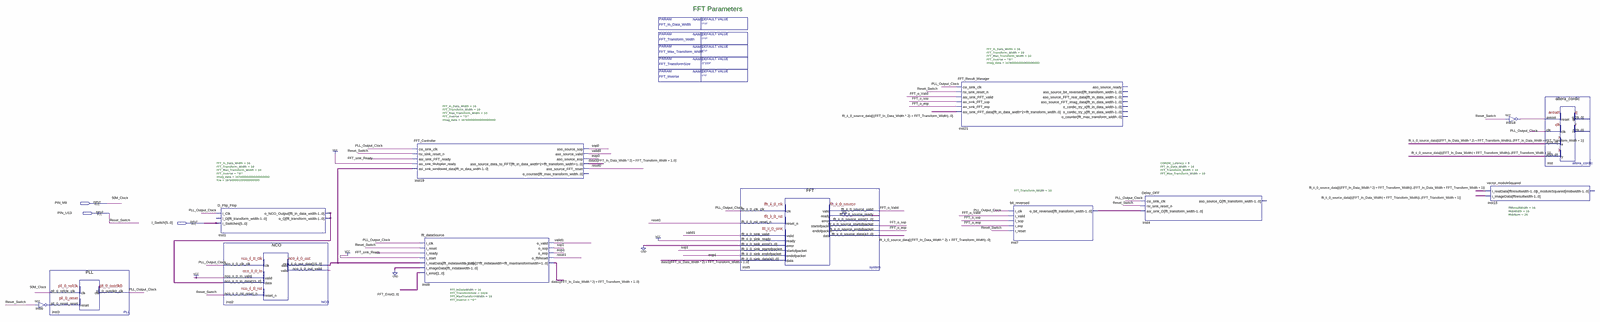
[diagram p0: schematic sheet, whole]
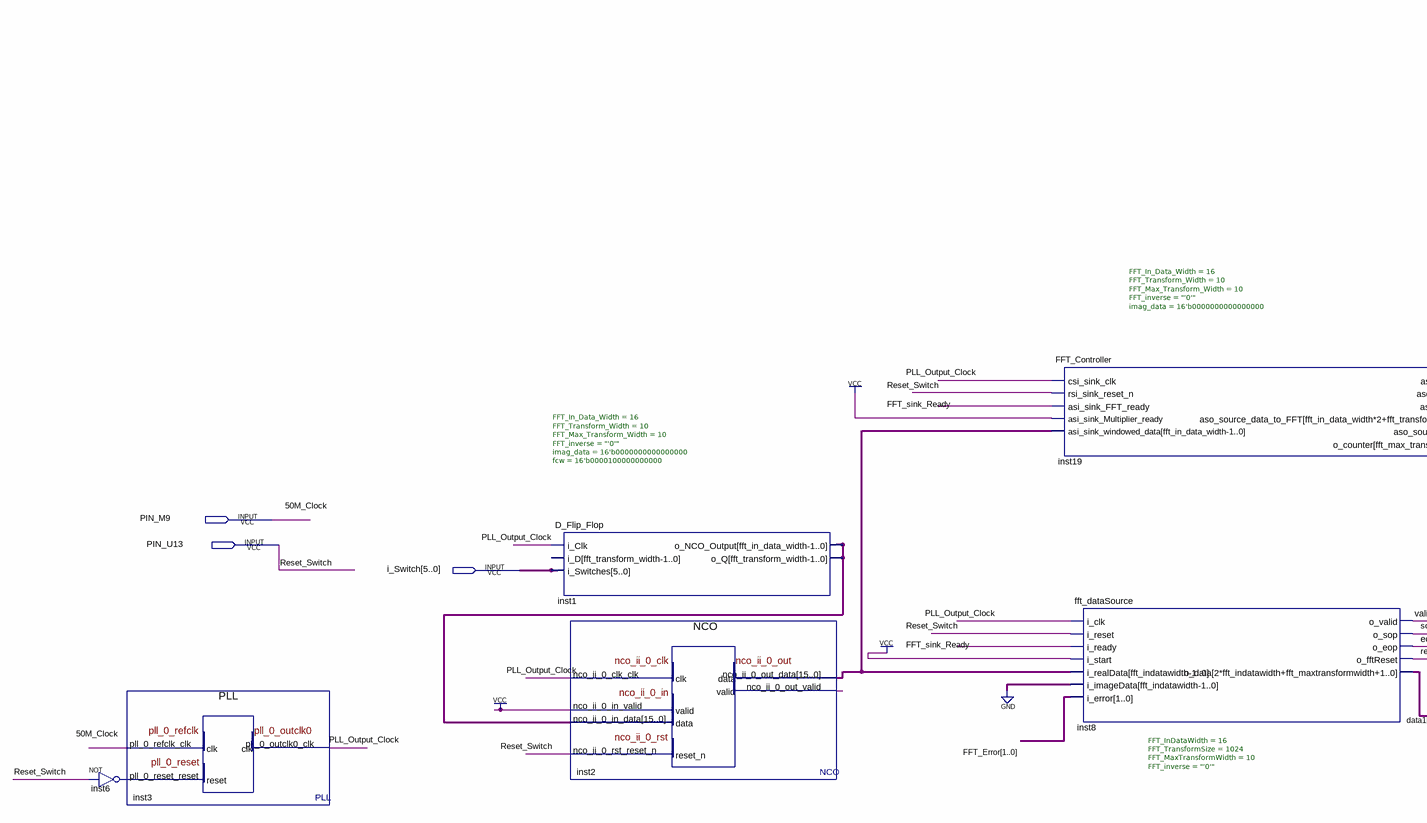
[diagram p1: schematic sheet, left part]
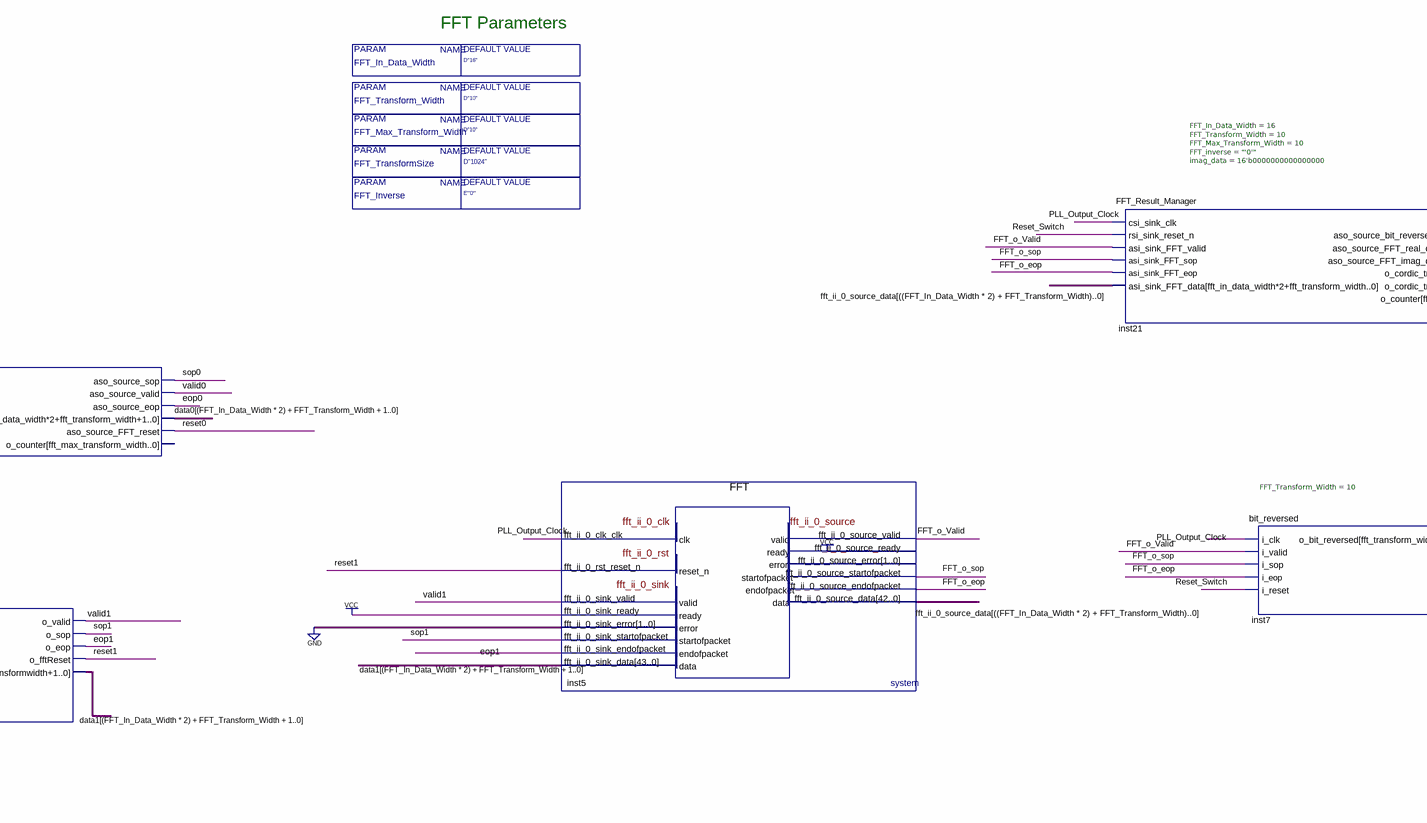
[diagram p2: schematic sheet, centre part]
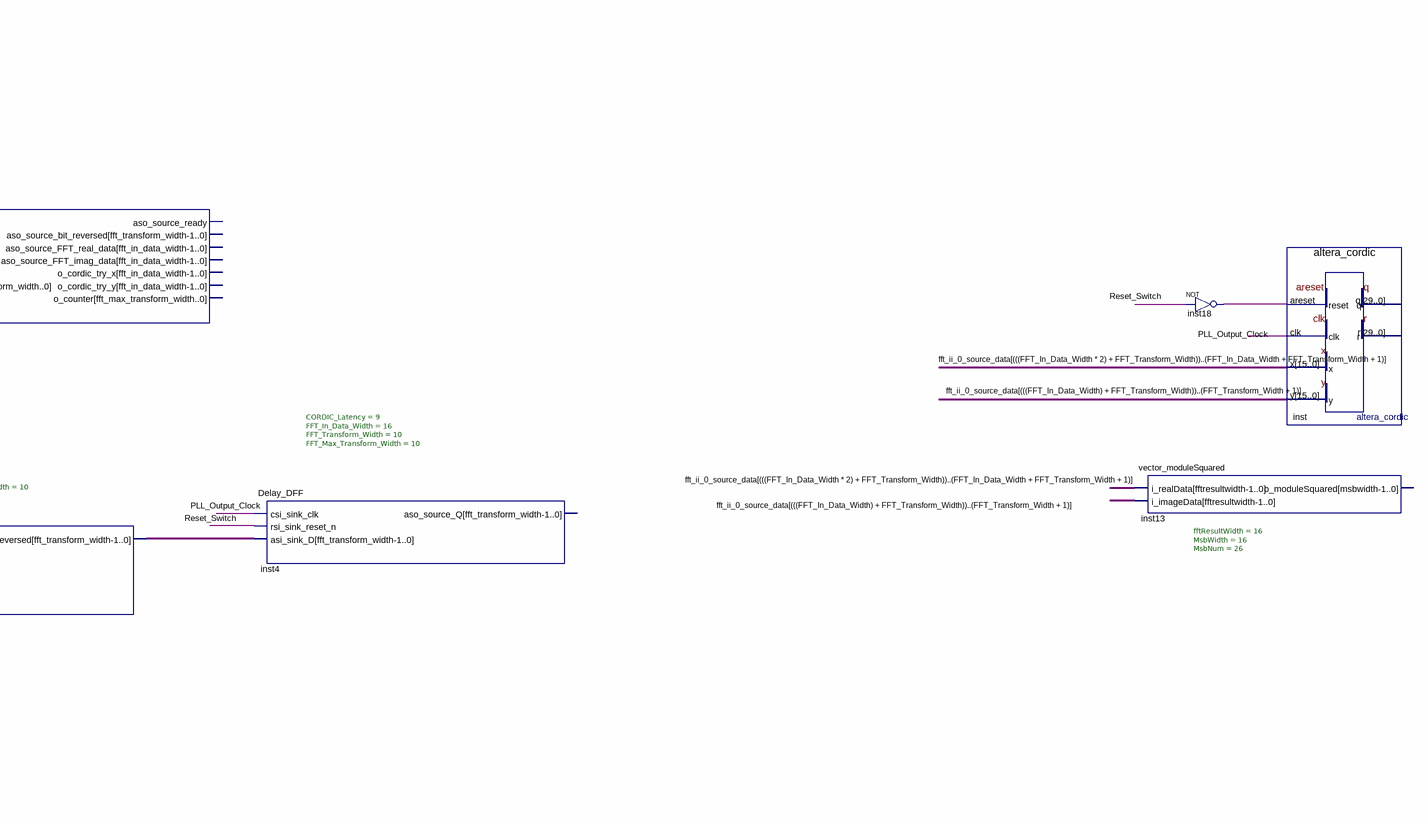
[diagram p3: schematic sheet, right part]
// Quartus schematic Yoav_FFT_Try.bdf as structural Verilog: 13 symbols, 3 pins
module Yoav_FFT_Try #(parameter FFT_Inverse = "E\"'0'\"", parameter FFT_In_Data_Width = "D\"16\"", parameter FFT_TransformSize = "D\"1024\"", parameter FFT_Transform_Width = "D\"10\"", parameter FFT_Max_Transform_Width = "D\"10\"") (
  input  PIN_M9,
  input  PIN_U13,
  input  [5:0] i_Switch
);

  wire \data0[(FFT_In_Data_Width_*_2)_+_FFT_Transform_Width_+_1..0] ,
       \data1[(FFT_In_Data_Width_*_2)_+_FFT_Transform_Width_+_1..0] , eop0, eop1,
       \fft_ii_0_source_data[(((FFT_In_Data_Width_*_2)_+_FFT_Transform_Width))..(FFT_In_Data_Width_+_FFT_Transform_Width_+_1)] ,
       \fft_ii_0_source_data[(((FFT_In_Data_Width)_+_FFT_Transform_Width))..(FFT_Transform_Width_+_1)] ,
       \fft_ii_0_source_data[((FFT_In_Data_Width_*_2)_+_FFT_Transform_Width)..0] , FFT_o_eop, FFT_o_sop,
       FFT_o_Valid, FFT_sink_Ready, inst2_nco_ii_0_out_valid, inst5_fft_ii_0_sink_ready, inst6_out,
       inst18_out, PLL_Output_Clock, reset0, reset1, sop0, sop1, valid0, valid1;
  wire [1:0] FFT_Error;
  wire [9:0] inst7_o_bit_reversed;
  wire [15:0] inst1_o_nco_output, inst2_nco_ii_0_out_data;

  not inst6 (inst6_out, PIN_U13);
  PLL inst3 (.pll_0_refclk_clk(PIN_M9), .pll_0_reset_reset(inst6_out), .pll_0_outclk0_clk(PLL_Output_Clock));
  D_Flip_Flop #(.FFT_In_Data_Width(16), .FFT_Transform_Width(10), .FFT_Max_Transform_Width(10), .FFT_inverse("'0'"), .imag_data(16'b0000000000000000), .fcw(16'b0000100000000000)) inst1 (
    .i_Clk(PLL_Output_Clock), .i_Switches(i_Switch), .o_NCO_Output(inst1_o_nco_output),
    .o_Q(inst1_o_nco_output));  // open: i_D
  NCO inst2 (
    .nco_ii_0_clk_clk(PLL_Output_Clock), .nco_ii_0_in_valid(1'b1), .nco_ii_0_in_data(inst1_o_nco_output),
    .nco_ii_0_rst_reset_n(PIN_U13), .nco_ii_0_out_data(inst2_nco_ii_0_out_data),
    .nco_ii_0_out_valid(inst2_nco_ii_0_out_valid));
  FFT_Controller #(.FFT_In_Data_Width(16), .FFT_Transform_Width(10), .FFT_Max_Transform_Width(10), .FFT_inverse("'0'"), .imag_data(16'b0000000000000000)) inst19 (
    .csi_sink_clk(PLL_Output_Clock), .rsi_sink_reset_n(PIN_U13), .asi_sink_FFT_ready(FFT_sink_Ready),
    .asi_sink_Multiplier_ready(1'b1), .asi_sink_windowed_data(inst2_nco_ii_0_out_data),
    .aso_source_sop(sop0), .aso_source_valid(valid0), .aso_source_eop(eop0),
    .aso_source_data_to_FFT(\data0[(FFT_In_Data_Width_*_2)_+_FFT_Transform_Width_+_1..0] ),
    .aso_source_FFT_reset(reset0));  // open: o_counter
  fft_dataSource #(.FFT_InDataWidth(16), .FFT_TransformSize(1024), .FFT_MaxTransformWidth(10), .FFT_inverse("'0'")) inst8 (
    .i_clk(PLL_Output_Clock), .i_reset(PIN_U13), .i_ready(FFT_sink_Ready), .i_start(1'b1),
    .i_realData(inst2_nco_ii_0_out_data), .i_imageData({16{1'b0}}), .i_error(FFT_Error), .o_valid(valid1),
    .o_sop(sop1), .o_eop(eop1), .o_fftReset(reset1),
    .o_data(\data1[(FFT_In_Data_Width_*_2)_+_FFT_Transform_Width_+_1..0] ));
  FFT inst5 (
    .fft_ii_0_clk_clk(PLL_Output_Clock), .fft_ii_0_rst_reset_n(reset1), .fft_ii_0_sink_valid(valid1),
    .fft_ii_0_sink_error(2'b00), .fft_ii_0_sink_startofpacket(sop1), .fft_ii_0_sink_endofpacket(eop1),
    .fft_ii_0_sink_data({44{\data1[(FFT_In_Data_Width_*_2)_+_FFT_Transform_Width_+_1..0] }}),
    .fft_ii_0_source_ready(1'b1), .fft_ii_0_sink_ready(inst5_fft_ii_0_sink_ready),
    .fft_ii_0_source_valid(FFT_o_Valid), .fft_ii_0_source_startofpacket(FFT_o_sop),
    .fft_ii_0_source_endofpacket(FFT_o_eop),
    .fft_ii_0_source_data(\fft_ii_0_source_data[((FFT_In_Data_Width_*_2)_+_FFT_Transform_Width)..0] ));  // open: fft_ii_0_source_error
  FFT_Result_Manager #(.FFT_In_Data_Width(16), .FFT_Transform_Width(10), .FFT_Max_Transform_Width(10), .FFT_inverse("'0'"), .imag_data(16'b0000000000000000)) inst21 (
    .csi_sink_clk(PLL_Output_Clock), .rsi_sink_reset_n(PIN_U13), .asi_sink_FFT_valid(FFT_o_Valid),
    .asi_sink_FFT_sop(FFT_o_sop), .asi_sink_FFT_eop(FFT_o_eop),
    .asi_sink_FFT_data({43{\fft_ii_0_source_data[((FFT_In_Data_Width_*_2)_+_FFT_Transform_Width)..0] }}));  // open: aso_source_ready, aso_source_bit_reversed, aso_source_FFT_real_data, aso_source_FFT_imag_data, o_cordic_try_x, o_cordic_try_y, o_counter
  bit_reversed #(.FFT_Transform_Width(10)) inst7 (
    .i_clk(PLL_Output_Clock), .i_valid(FFT_o_Valid), .i_sop(FFT_o_sop), .i_eop(FFT_o_eop), .i_reset(PIN_U13),
    .o_bit_reversed(inst7_o_bit_reversed));
  Delay_DFF #(.CORDIC_Latency(9), .FFT_In_Data_Width(16), .FFT_Transform_Width(10), .FFT_Max_Transform_Width(10)) inst4 (
    .csi_sink_clk(PLL_Output_Clock), .rsi_sink_reset_n(PIN_U13), .asi_sink_D(inst7_o_bit_reversed));  // open: aso_source_Q
  vector_moduleSquared #(.fftResultWidth(16), .MsbWidth(16), .MsbNum(26)) inst13 (
    .i_realData({16{\fft_ii_0_source_data[(((FFT_In_Data_Width_*_2)_+_FFT_Transform_Width))..(FFT_In_Data_Width_+_FFT_Transform_Width_+_1)] }}),
    .i_imageData({16{\fft_ii_0_source_data[(((FFT_In_Data_Width)_+_FFT_Transform_Width))..(FFT_Transform_Width_+_1)] }}));  // open: o_moduleSquared
  not inst18 (inst18_out, PIN_U13);
  altera_cordic inst (
    .areset(inst18_out), .clk(PLL_Output_Clock),
    .x({16{\fft_ii_0_source_data[(((FFT_In_Data_Width_*_2)_+_FFT_Transform_Width))..(FFT_In_Data_Width_+_FFT_Transform_Width_+_1)] }}),
    .y({16{\fft_ii_0_source_data[(((FFT_In_Data_Width)_+_FFT_Transform_Width))..(FFT_Transform_Width_+_1)] }}));  // open: q, r
  // also tied to VCC on the sheet: inst5_fft_ii_0_sink_ready

  // Other names for the same wires on the sheet: 50M_Clock = PIN_M9; Reset_Switch = PIN_U13

  // Notes on the sheet:
  //   FFT Parameters
endmodule
